# Altium schematic sheet Schematic MotherBoard.SchDoc
size A3; SheetNumber: 1; SheetTotal: 3
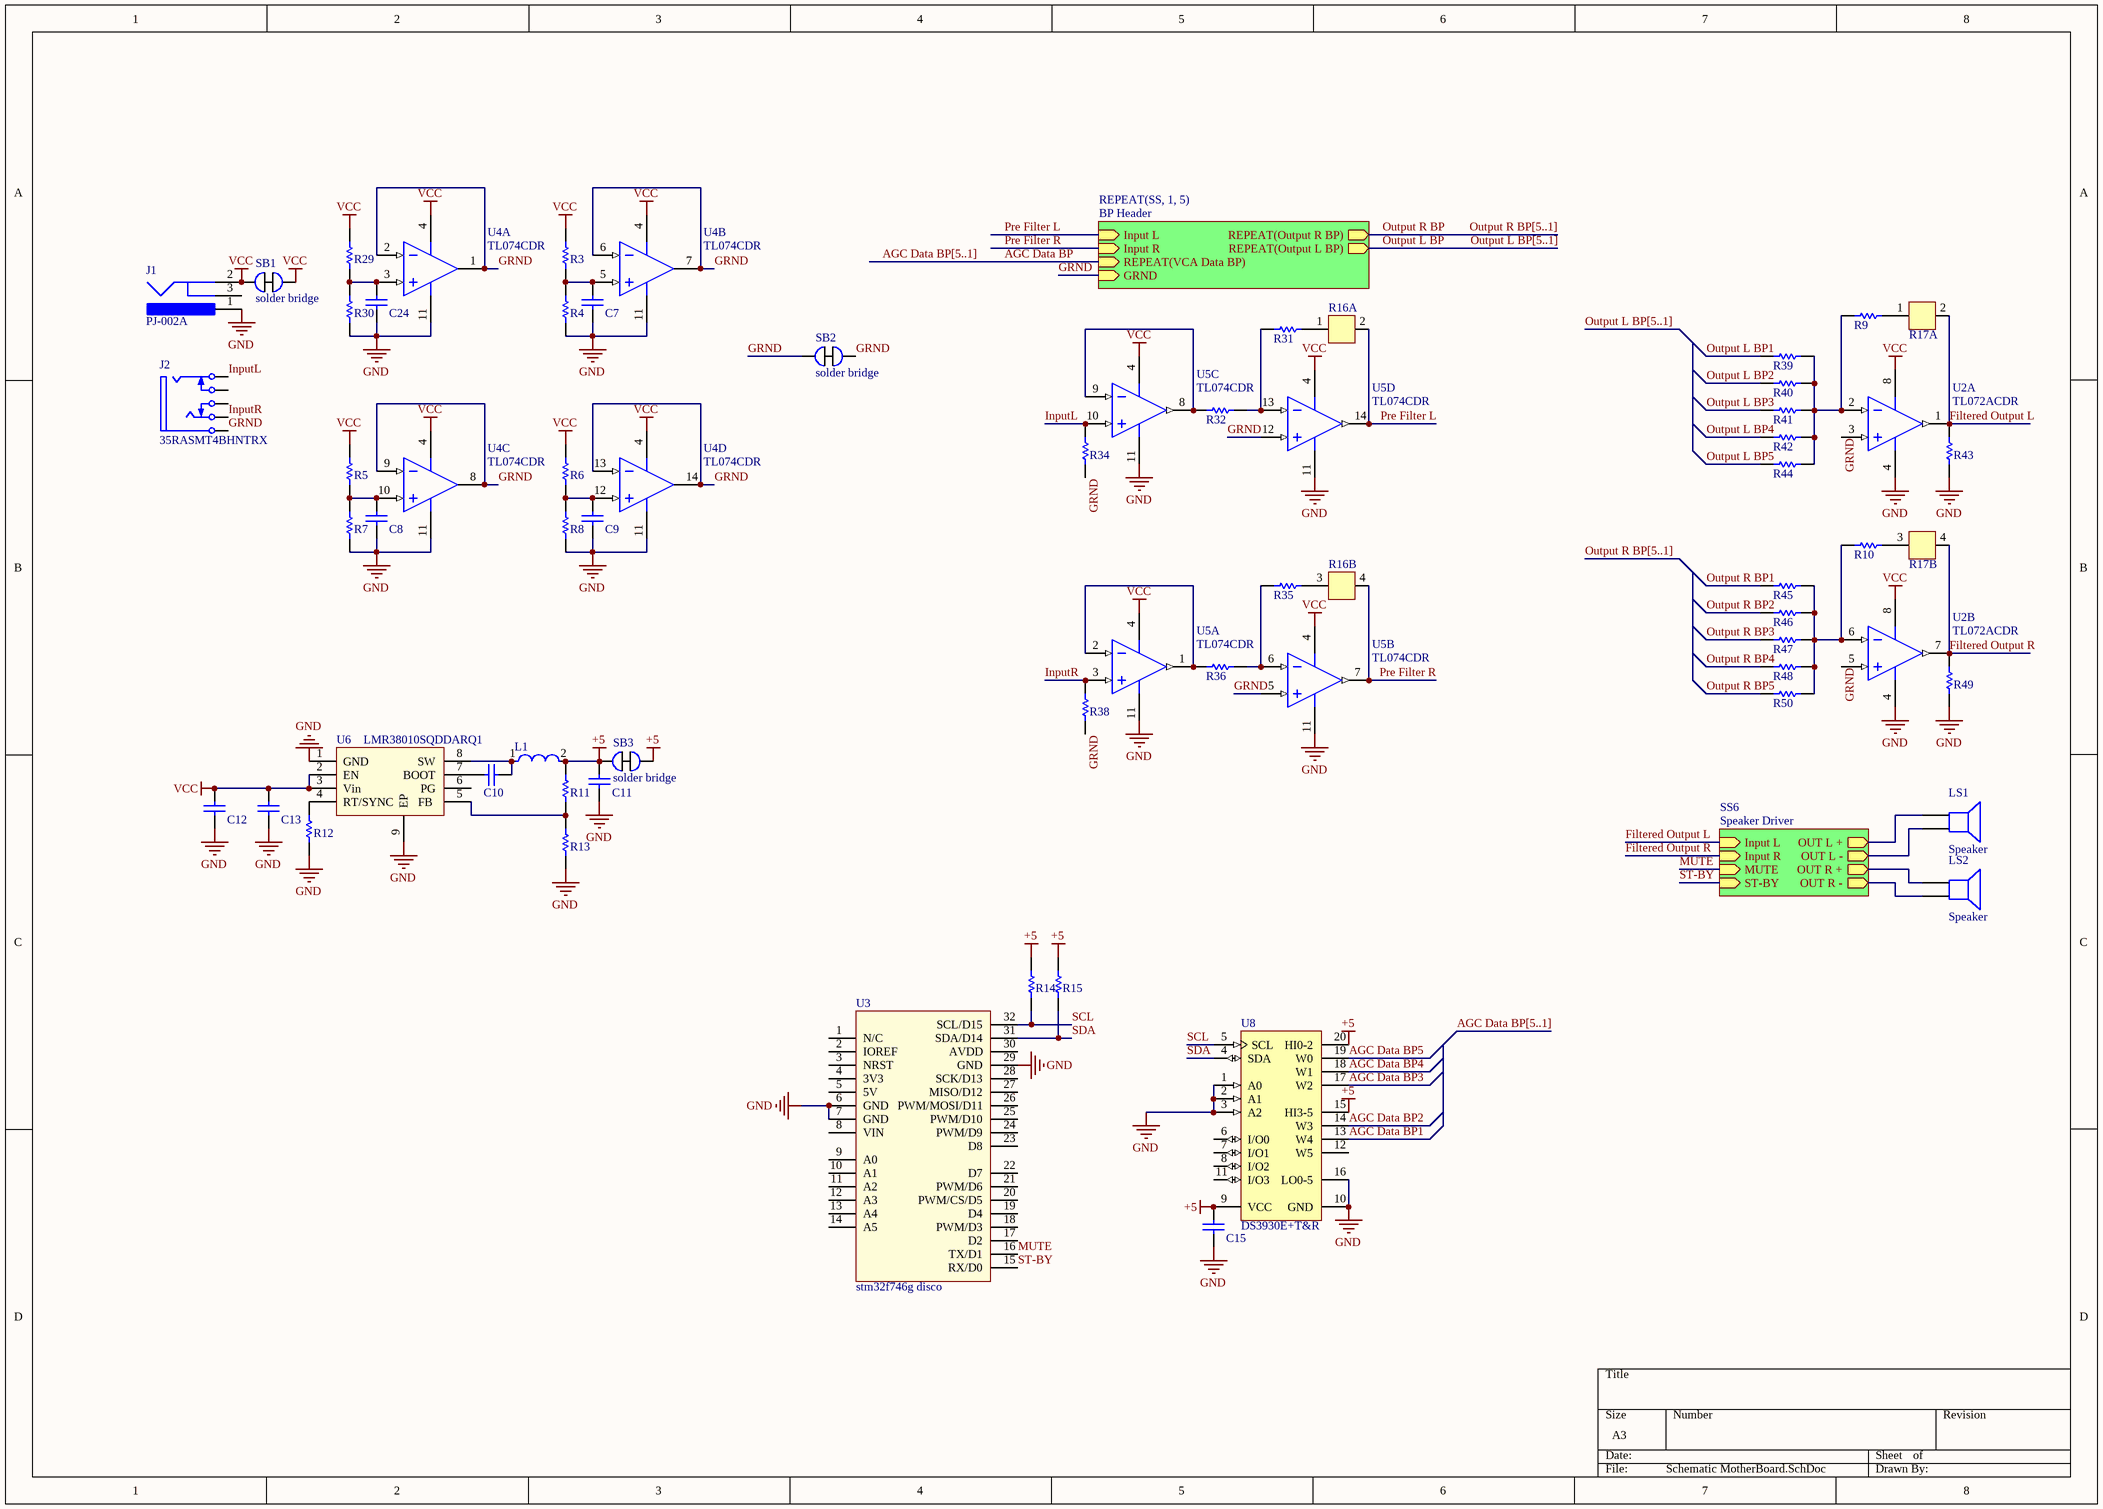
[diagram p0: Schematic MotherBoard.SchDoc]

## Parts
C7  1206GC102KAT1A  [AVX-1206-2_L]  (value not drawn)
C8  1206GC102KAT1A  [AVX-1206-2_L]  (value not drawn)
C9  1206GC102KAT1A  [AVX-1206-2_L]  (value not drawn)
C10  1206GC102KAT1A  [AVX-1206-2_L]  (value not drawn)
C11  1206GC102KAT1A  [AVX-1206-2_L]  (value not drawn)
C12  1206GC102KAT1A  [AVX-1206-2_L]  (value not drawn)
C13  1206GC102KAT1A  [AVX-1206-2_L]  (value not drawn)
C15  1206GC102KAT1A  [AVX-1206-2_L]  (value not drawn)
C24  1206GC102KAT1A  [AVX-1206-2_L]  (value not drawn)
J1  PJ-002A  [CUI-PJ-002A_V]
J2  35RASMT4BHNTRX  [SWIT-35RASMT4BHNTRX_V]
L1  IHLP5050EZERR56M01  [FP-IHLP-5050EZ-FP_3_226x4-MFG]  (value not drawn)
LS1  Speaker  [PIN2]
LS2  Speaker  [PIN2]
R3  ERJ-8GEY0R00V  [RESC3216X70X50NL05T20]  (value not drawn)
R4  ERJ-8GEY0R00V  [RESC3216X70X50NL05T20]  (value not drawn)
R5  ERJ-8GEY0R00V  [RESC3216X70X50NL05T20]  (value not drawn)
R6  ERJ-8GEY0R00V  [RESC3216X70X50NL05T20]  (value not drawn)
R7  ERJ-8GEY0R00V  [RESC3216X70X50NL05T20]  (value not drawn)
R8  ERJ-8GEY0R00V  [RESC3216X70X50NL05T20]  (value not drawn)
R9  ERJ-8GEY0R00V  [RESC3216X70X50NL05T20]  (value not drawn)
R10  ERJ-8GEY0R00V  [RESC3216X70X50NL05T20]  (value not drawn)
R11  ERJ-8GEY0R00V  [RESC3216X70X50NL05T20]  (value not drawn)
R12  ERJ-8GEY0R00V  [RESC3216X70X50NL05T20]  (value not drawn)
R13  ERJ-8GEY0R00V  [RESC3216X70X50NL05T20]  (value not drawn)
R14  ERJ-8GEY0R00V  [RESC3216X70X50NL05T20]  (value not drawn)
R15  ERJ-8GEY0R00V  [RESC3216X70X50NL05T20]  (value not drawn)
R16  Pot probes  [Pot probe]  (value not drawn)  (parts A,B of 2)
R17  Pot probes  [Pot probe]  (value not drawn)  (parts A,B of 2)
R29  ERJ-8GEY0R00V  [RESC3216X70X50NL05T20]  (value not drawn)
R30  ERJ-8GEY0R00V  [RESC3216X70X50NL05T20]  (value not drawn)
R31  ERJ-8GEY0R00V  [RESC3216X70X50NL05T20]  (value not drawn)
R32  ERJ-8GEY0R00V  [RESC3216X70X50NL05T20]  (value not drawn)
R34  ERJ-8GEY0R00V  [RESC3216X70X50NL05T20]  (value not drawn)
R35  ERJ-8GEY0R00V  [RESC3216X70X50NL05T20]  (value not drawn)
R36  ERJ-8GEY0R00V  [RESC3216X70X50NL05T20]  (value not drawn)
R38  ERJ-8GEY0R00V  [RESC3216X70X50NL05T20]  (value not drawn)
R39  ERJ-8GEY0R00V  [RESC3216X70X50NL05T20]  (value not drawn)
R40  ERJ-8GEY0R00V  [RESC3216X70X50NL05T20]  (value not drawn)
R41  ERJ-8GEY0R00V  [RESC3216X70X50NL05T20]  (value not drawn)
R42  ERJ-8GEY0R00V  [RESC3216X70X50NL05T20]  (value not drawn)
R43  ERJ-8GEY0R00V  [RESC3216X70X50NL05T20]  (value not drawn)
R44  ERJ-8GEY0R00V  [RESC3216X70X50NL05T20]  (value not drawn)
R45  ERJ-8GEY0R00V  [RESC3216X70X50NL05T20]  (value not drawn)
R46  ERJ-8GEY0R00V  [RESC3216X70X50NL05T20]  (value not drawn)
R47  ERJ-8GEY0R00V  [RESC3216X70X50NL05T20]  (value not drawn)
R48  ERJ-8GEY0R00V  [RESC3216X70X50NL05T20]  (value not drawn)
R49  ERJ-8GEY0R00V  [RESC3216X70X50NL05T20]  (value not drawn)
R50  ERJ-8GEY0R00V  [RESC3216X70X50NL05T20]  (value not drawn)
SB1  solder bridge  [solder bridge]
SB2  solder bridge  [solder bridge]
SB3  solder bridge  [solder bridge]
U2  TL072ACDR  [D0008A_M]  (parts A,B of 2)
U3  stm32f746g disco  [stm32f746g disco]
U4  TL074CDR  [D0014A_N]  (parts A,B,C,D of 4)
U5  TL074CDR  [D0014A_N]  (parts A,B,C,D of 4)
U6  LMR38010SQDDARQ1  [LMR38010SQDDARQ1]
U8  DS3930E+T&R  [MAXM-U20+5_L]

## Sub-sheets
REPEAT(SS, 1, 5) = BP Header: Input L (in), Input R (in), REPEAT(Output R BP) (out), REPEAT(Output L BP) (out), REPEAT(VCA Data BP) (in), GRND (in)
SS6 = Speaker Driver: ST-BY (in), Input R (in), Input L (in), MUTE (in), OUT L + (out), OUT R - (out), OUT R + (out), OUT L - (out)

## Nets
+5: C11.2 C15.2 L1.2 R11.2 R14.2 R15.2 SB3.1 SB3.2 U8.9(VCC) U8.15(HI3-5) U8.20(HI0-2)
GND: C7.1 C8.1 C9.1 C11.1 C12.1 C13.1 C15.1 C24.1 J1.1 R4.1 R7.1 R8.1 R12.1 R13.1 R30.1 R43.2 R49.2 U2.4(VCC-) U3.6(GND) U3.7(GND) U3.29(GND) U4.11(VCC-) U5.11(VCC-) U6.1(GND) U6.9(EP) U8.1(A0) U8.2(A1) U8.3(A2) U8.10(GND) U8.16(LO0-5)
VCC: C12.2 C13.2 J1.2 R3.1 R5.1 R6.1 R29.1 SB1.1 SB1.2 U2.8(VCC+) U4.4(VCC+) U5.4(VCC+) U6.2(EN) U6.3(Vin)
AGC Data BP: sheet REPEAT(SS, 1, 5)/REPEAT(VCA Data BP)
AGC Data BP1: U8.13(W4)
AGC Data BP2: U8.14(W3)
AGC Data BP3: U8.17(W2)
AGC Data BP4: U8.18(W1)
AGC Data BP5: U8.19(W0)
Filtered Output L: R17.2 R43.1 U2.1(OUT1) ; sheet SS6/Input L
Filtered Output R: R17.4 R49.1 U2.7(OUT2) ; sheet SS6/Input R
GRND: J2.1 R34.2 R38.2 SB2.1 SB2.2 U2.3(IN1+) U2.5(IN2+) U4.1(OUT1) U4.2(IN1-) U4.6(IN2-) U4.7(OUT2) U4.8(OUT3) U4.9(IN3-) U4.13(IN4-) U4.14(OUT4) U5.5(IN2+) U5.12(IN4+) ; sheet REPEAT(SS, 1, 5)/GRND
InputL: J2.2 R34.1 U5.10(IN3+)
InputR: J2.3 R38.1 U5.3(IN1+)
MUTE: U3.16(TX/D1) ; sheet SS6/MUTE
Output L BP: sheet REPEAT(SS, 1, 5)/REPEAT(Output L BP)
Output L BP1: R39.1
Output L BP2: R40.1
Output L BP3: R41.1
Output L BP4: R42.1
Output L BP5: R44.1
Output R BP: sheet REPEAT(SS, 1, 5)/REPEAT(Output R BP)
Output R BP1: R45.1
Output R BP2: R46.1
Output R BP3: R47.1
Output R BP4: R48.1
Output R BP5: R50.1
Pre Filter L: R16.2 U5.14(OUT4) ; sheet REPEAT(SS, 1, 5)/Input L
Pre Filter R: R16.4 U5.7(OUT2) ; sheet REPEAT(SS, 1, 5)/Input R
SCL: R14.1 U3.32(SCL/D15) U8.5(SCL)
SDA: R15.1 U3.31(SDA/D14) U8.4(SDA)
ST-BY: U3.15(RX/D0) ; sheet SS6/ST-BY
NetC7_2: C7.2 R3.2 R4.2 U4.5(IN2+)
NetC8_2: C8.2 R5.2 R7.2 U4.10(IN3+)
NetC9_2: C9.2 R6.2 R8.2 U4.12(IN4+)
NetC10_1: C10.1 L1.1 U6.8(SW)
NetC10_2: C10.2 U6.7(BOOT)
NetC24_2: C24.2 R29.2 R30.2 U4.3(IN1+)
NetLS1_1: LS1.1 ; sheet SS6/OUT L +
NetLS1_2: LS1.2 ; sheet SS6/OUT L -
NetLS2_1: LS2.1 ; sheet SS6/OUT R -
NetLS2_2: LS2.2 ; sheet SS6/OUT R +
NetR9_1: R9.1 R39.2 R40.2 R41.2 R42.2 R44.2 U2.2(IN1-)
NetR9_2: R9.2 R17.1
NetR10_1: R10.1 R45.2 R46.2 R47.2 R48.2 R50.2 U2.6(IN2-)
NetR10_2: R10.2 R17.3
NetR11_1: R11.1 R13.2 U6.5(FB)
NetR12_2: R12.2 U6.4(RT/SYNC)
NetR16_1: R16.1 R31.2
NetR16_3: R16.3 R35.2
NetR31_1: R31.1 R32.2 U5.13(IN4-)
NetR32_1: R32.1 U5.8(OUT3) U5.9(IN3-)
NetR35_1: R35.1 R36.2 U5.6(IN2-)
NetR36_1: R36.1 U5.1(OUT1) U5.2(IN1-)

Not connected (* = marked no-connect by the designer): J1 3; J2 4 5; U3 1(N/C) 2(IOREF) 3(NRST) 4(3V3) 5(5V) 8(VIN) 9(A0) 10(A1) 11(A2) 12(A3) 13(A4) 14(A5) 17(D2) 18(PWM/D3) 19(D4) 20(PWM/CS/D5) 21(PWM/D6) 22(D7) 23(D8) 24(PWM/D9) 25(PWM/D10) 26(PWM/MOSI/D11) 27(MISO/D12) 28(SCK/D13) 30(AVDD); U6 6(PG); U8 6(I/O0) 7(I/O1) 8(I/O2) 11(I/O3) 12(W5)

## Buses and harness runs
bus AGC Data BP[5..1]
bus Output L BP[5..1]
bus Output R BP[5..1]

## Library data of the parts
C7-C13 C15 C24 = CMP-2000-05468-1: Chip Capacitor, 1 nF, +/- 10%, -55 to 125 degC, 1206 (3216 Metric), RoHS, Tape and Reel; Manufacturer: AVX; Capacitance: 0.001uF; Dielectric: X7R; Voltage Rating DC: 2000V; Package Reference: 1206; Datasheet Version: 11/2010; Mounting Technology: SurfaceMount; Manufacturer URL: http://www.avx.com/; Tolerance: 10%; Tolerance (%): ±10%; PartNumber: 1206GC102KAT1A; Datasheet URL: https://datasheet.ciiva.com/11787/0900766b80ed4c37-11787781.pdf; Package Description: 2-Pin SMD, Body 3.4 x 1.8 mm; Case Size/Dimension: 1206; Rated Voltage: 2000V
J1 = CMP-2000-06895-2: Through Hole Right Angle DC Power Jack, 2.5 A, 2 mm Center Pin, 3 Position, -25 to 85 degC, RoHS, Bulk; Manufacturer: CUIInc.; Brand: CUI; Inside Contact Diameter: 2mm; Voltage Rating: 24V; Outside Contact Diameter: 6.5mm; Current Rating: 2.5A; Insulation Resistance: 50MOhms; Contact Gender: Male; Connector Type: DCPowerJack; Datasheet Version: Rev. 1.03, 04/2016; Housing Material: PolybutyleneTerephthalate(PBT); Operating Temperature Range: -25Cto+85C; Termination Style: ThroughHole; Product Category: DCPowerConnectors; Mounting Technology: ThroughHole; Mounting Style: ThroughHole; Factory Pack Quantity: 500; Contact Plating: Nickel; Package Reference: PJ-002A; Mounting Angle: Right; Package Description: 3-Pin Through Hole Device, Body 14.4 x 9 mm, Height 11 mm; Flammability Rating: UL94V-0; Manufacturer URL: http://www.cui.com/; Product: Jacks; Contact Material: Copper; Datasheet URL: http://www.cui.com/product/resource/pj-002a.pdf; RoHS: True
J2 = CMP-1772-00001-1: Female 3.5 mm Phone Jack, 5 Position, Height 5 mm, RoHS, Tape and Reel; Current Rating: 50 mA; Voltage Rating (DC): 12 V; ComponentLink1URL: http://www.switchcraft.com/; ComponentLink2Description: Datasheet; ComponentLink2URL: http://www.switchcraft.com/Drawings/35rasmt4bhntrx_cd.pdf; PackageDescription: Female 3.5 mm Phone Jack, 5 Position, Height 5 mm; PackageReference: 35RASMT4BHNTRX; Mount: Through Hole; DatasheetVersion: Rev. C, 07/2014; Contact Material: Silver; ComponentLink1Description: Manufacturer URL; Packaging: Tape and Reel; RoHSCompliant: true; Contact Plating: Silver; Package Quantity: 3000
L1 = CMP-02424-000148-1: Commercial Inductors, High Saturation Series 0.56uH 36A 1.5mΩ 20%; Inductance: 560nH; Test Frequency: 100kHz; Core Material: Ferrite; Max DC Current: 55A; DC Resistance (DCR): 1.5mR; Self Resonant Frequency: 5MHz; Shielding: Shielded; Number of Pins: 5050; RMS Current (Irms): 36A; Height - Seated (Max): 0.197inch; Packaging: Tape and Reel; Military Standard: Not; Package Quantity: 250; Current Rating: 36A; Tolerance: 20%; Case/Package: 5050; Termination: SMD/SMT; Lead Free: Lead Free; Min Operating Temperature: -55°C; Length: 13.2mm; Inductance Tolerance: 20%; Mount: Surface Mount; Height: 5mm; Saturation Current: 55A; Width: 0.508inch; Max Operating Temperature: 125°C; Depth: 12.9mm; Radiation Hardening: No
LS1 LS2 = Speaker: Loudspeaker; Published: 24-Mar-1999; LatestRevisionDate: 17-Jul-2002; LatestRevisionNote: Re-released for DXP Platform.; PackageReference: PIN2; Publisher: Altium Limited
R3-R15 R29-R32 R34-R36 R38-R50 = CMP-2003-00541-1: Manufacturer: Panasonic; Part Number: ERJ-8GEY0R00V
U2 = CMP-0017-00380-2: Low-Noise JFET-Input Operational Amplifier, 7 to 36 V, 0 to 70 degC, 8-pin SOIC (D8), Green (RoHS & no Sb/Br); Manufacturer: Texas Instruments; Sub Family: General Purpose Amplifier, High Supply Voltage Amplifier (>=30V); Vn at 1kHz(Typ)(nV/rtHz): 18; Rating: Catalog; IIB(Max)(pA): 200; Total Supply Voltage(Min)(+5V is 5, +/-5V is 10): 7; CMRR(Min)(dB): 75; Slew Rate(Typ)(V/us): 13; Iq per channel(Max)(mA): 2.5; GBW(Typ)(MHz): 3; Total Supply Voltage(Max)(+5V is 5, +/-5V is 10): 36; Vio (25C)(Max)(mV): 6; Number of Channels: 2; DatasheetVersion: SLOS080J; ComponentLink3URL: http://www.ti.com/litv/pdf/msoi002j; PackageReference: D0008A; Eco-Plan: Green (RoHS & no Sb/Br); PartNumber: TL072ACDR; PackageDescription: 8-Pin Plastic Small Outline, Body 4.9 x 3.9 mm, Pitch 1.27 mm; ComponentLink2Description: Datasheet; PackageVersion: 4040047-3/M, 06/2011; ComponentLink2URL: http://www.ti.com/lit/ds/symlink/tl072a.pdf; ComponentLink3Description: Package Specification; Offset Drift(Typ)(uV/C): 18; ComponentLink1URL: http://www.ti.com/; Mounting Technology: Surface Mount; Code_JEDEC: MS-012; ComponentLink1Description: Manufacturer URL
U4 U5 = CMP-0017-00003-2: Quad Low-Noise JFET-Input General-Purpose Operational Amplifier, 7 to 36 V, 0 to 70 degC, 14-pin SOIC (D14), Green (RoHS & no Sb/Br); Manufacturer: Texas Instruments; Slew Rate(Typ)(V/us): 13; IIB(Max)(pA): 200; Number of Channels: 4; CMRR(Min)(dB): 70; Vn at 1kHz(Typ)(nV/rtHz): 18; Vio (25C)(Max)(mV): 10; Sub Family: General Purpose Amplifier, High Supply Voltage Amplifier (>=30V); Total Supply Voltage(Max)(+5V is 5, +/-5V is 10): 36; Total Supply Voltage(Min)(+5V is 5, +/-5V is 10): 7; GBW(Typ)(MHz): 3; Rating: Military; Iq per channel(Max)(mA): 2.5; Eco-Plan: Green (RoHS & no Sb/Br); ComponentLink3Description: Package Specification; ComponentLink1URL: http://www.ti.com/; Mounting Technology: Surface Mount; ComponentLink3URL: http://www.ti.com/lit/ml/mpds177g/mpds177g.pdf; PartNumber: TL074CDR; DatasheetVersion: SLOS080J; ComponentLink2URL: http://www.ti.com/lit/ds/symlink/tl074.pdf; ComponentLink1Description: Manufacturer URL; PackageVersion: 4040047-5/M, 06/2011; PackageReference: D0014A; Code_JEDEC: MS-012; ComponentLink2Description: Datasheet; Offset Drift(Typ)(uV/C): 18; PackageDescription: 14-Pin Plastic Small Outline, Body 8.65 x 3.90 mm, Pitch 1.27 mm
U8 = CMP-0023-00559-1: Hex Unbuffered DAC with I/O and Memory with 2-Wire Addressable Control Interface, Non-Volatile, Linear Taper, 256 Steps, -40 to 85 degC, 20-pin TSSOP (U20+5), Pb-Free, Tape and Reel; Mounting Technology: Surface Mount; ComponentLink3Description: Package Specification; Control Interface: 2-Wire Addressable; Code_JEDEC: MO-153; PartNumber: DS3930E+T&R; DatasheetVersion: Rev. 0; PackageVersion: Rev. L, 07/2010; ComponentLink2URL: http://datasheets.maximintegrated.com/en/ds/DS3930.pdf; ComponentLink3URL: http://pdfserv.maximintegrated.com/package_dwgs/21-0066.PDF; PackageDescription: 20-Pin Thin Shrink Small-Outline Package (U20+5), Body 6.5 x 4.4 mm, Pitch 0.65 mm; ComponentLink1Description: Manufacturer URL; Features: EEPROM Wiper Memory, Varactor Tuning for RF Applications; ComponentLink2Description: Datasheet; ComponentLink1URL: http://www.maximintegrated.com/; PackageReference: U20+5